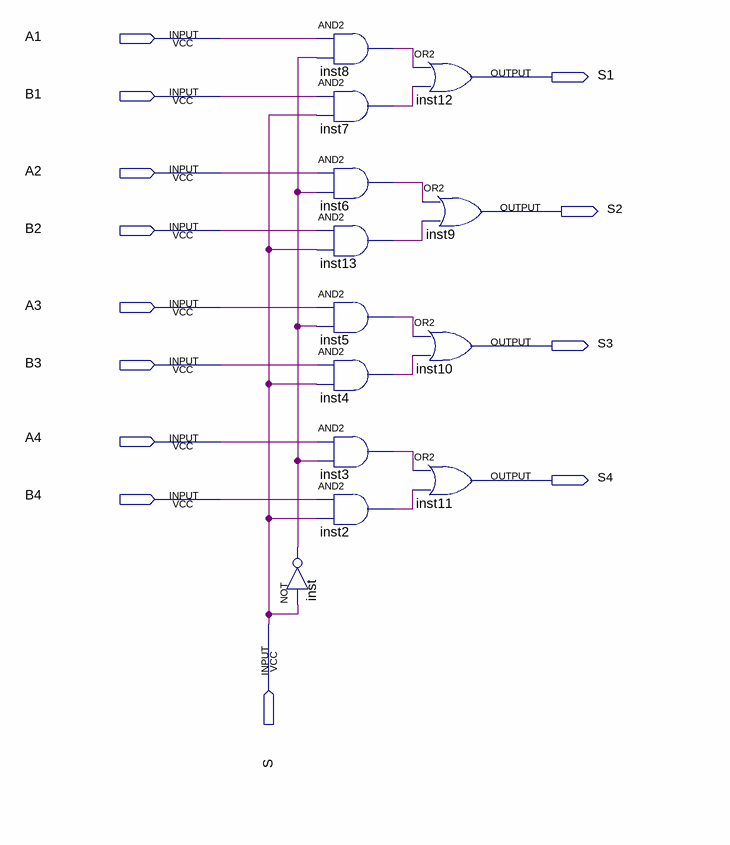
[diagram p0: schematic sheet]
// Quartus schematic mux_2x1_4bit.bdf as structural Verilog: 13 symbols, 13 pins
module mux_2x1_4bit (
  input  A1,
  input  B1,
  input  A2,
  input  B2,
  input  A3,
  input  B3,
  input  A4,
  input  B4,
  input  S,
  output S1,
  output S2,
  output S3,
  output S4
);

  wire inst2_out, inst3_out, inst4_out, inst5_out, inst6_out, inst7_out, inst8_out, inst13_out, inst_out;

  not inst (inst_out, S);
  and inst8 (inst8_out, A1, inst_out);
  and inst7 (inst7_out, B1, S);
  and inst6 (inst6_out, A2, inst_out);
  and inst13 (inst13_out, B2, S);
  and inst5 (inst5_out, A3, inst_out);
  and inst4 (inst4_out, B3, S);
  and inst3 (inst3_out, A4, inst_out);
  and inst2 (inst2_out, B4, S);
  or inst12 (S1, inst8_out, inst7_out);
  or inst9 (S2, inst6_out, inst13_out);
  or inst10 (S3, inst5_out, inst4_out);
  or inst11 (S4, inst3_out, inst2_out);
endmodule
